# EAGLE design sensor_f1 (EAGLE 8.4.2)
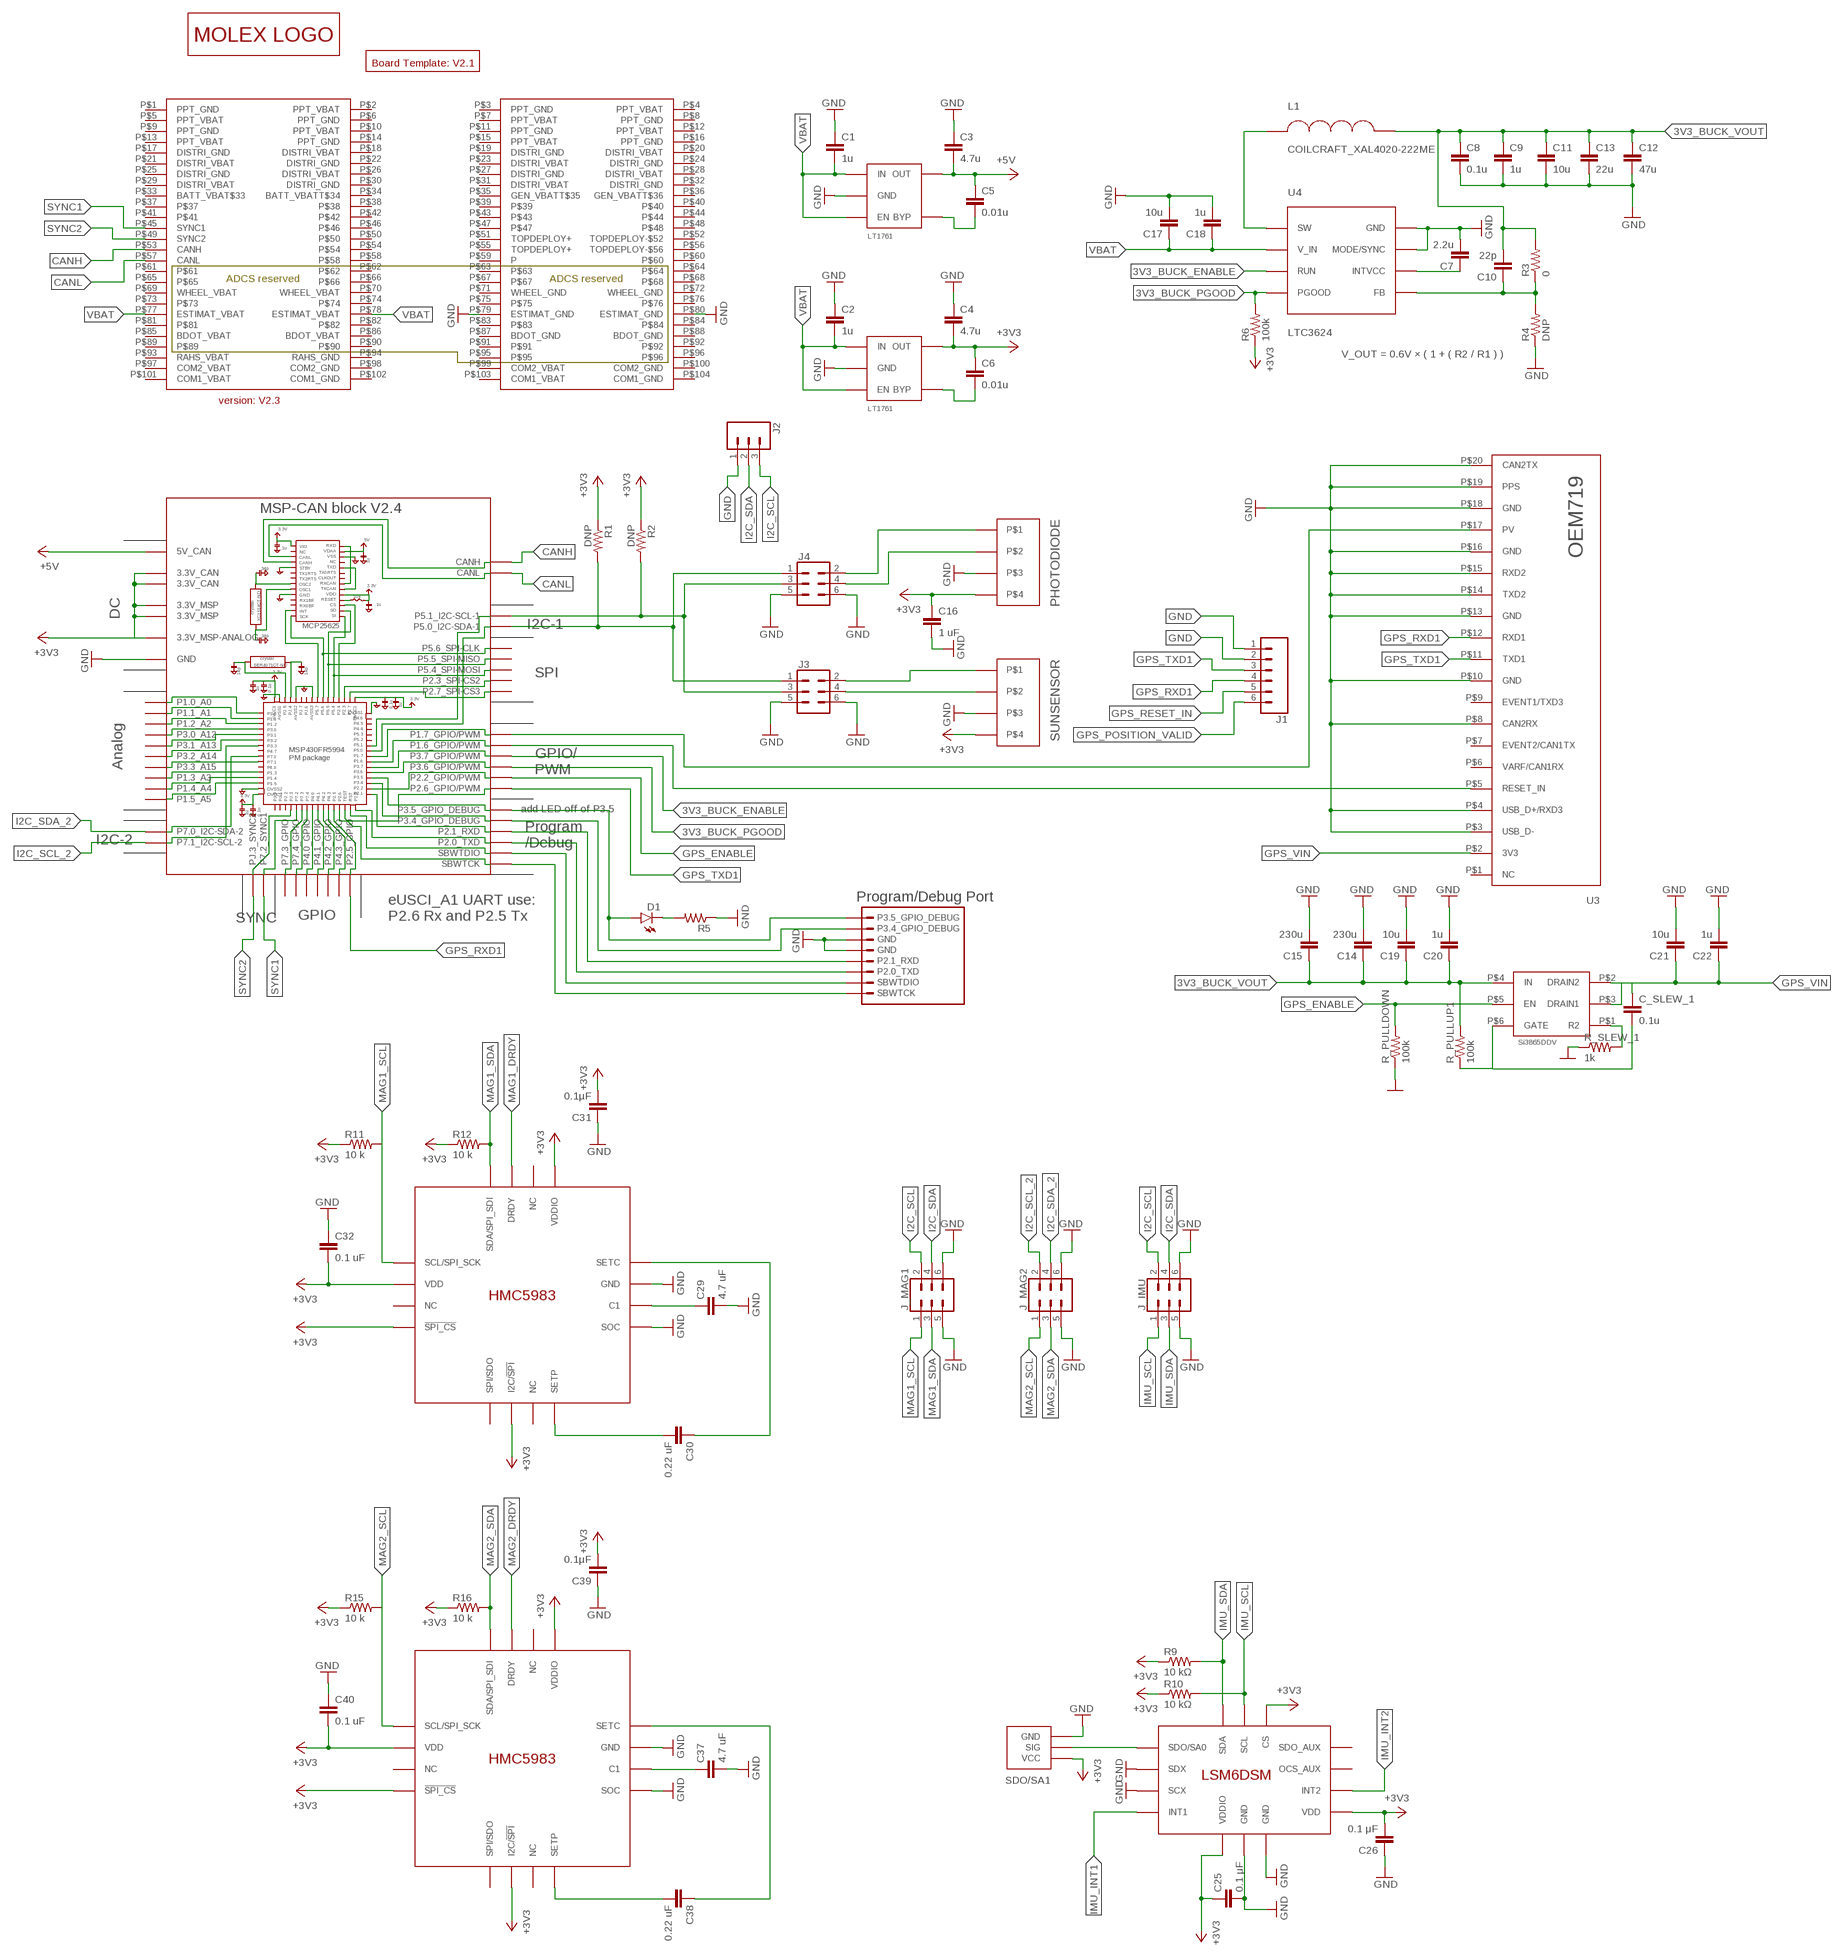
[diagram p0: schematic, sheet 1]

## Parts
B1  BOARD_TEMPLATESERCURED  [BOARD_TEMPLATE_SECURED]
BLK1  MSP-CAN_BLOCK  [MSP-CAN_BLOCK]
C1  1u  CAPACITOR0805  [0805]
C2  1u  CAPACITOR0805  [0805]
C3  4.7u  CAPACITOR0805  [0805]
C4  4.7u  CAPACITOR0805  [0805]
C5  0.01u  CAPACITOR0805  [0805]
C6  0.01u  CAPACITOR0805  [0805]
C7  2.2u  CAPACITOR0805  [0805]
C8  0.1u  CAPACITOR0805  [0805]
C9  1u  CAPACITOR0805  [0805]
C10  22p  CAPACITOR0805  [0805]
C11  10u  CAPACITOR0805  [0805]
C12  47u  CAPACITOR1206  [1206]
C13  22u  CAPACITOR1206  [1206]
C14  230u  CAPACITORPANASONIC_16SVPG270M  [PANASONIC_SVPG]
C15  230u  CAPACITORPANASONIC_16SVPG270M  [PANASONIC_SVPG]
C16  1 uF  CAPACITOR0805  [0805]
C17  10u  CAPACITOR0805  [0805]
C18  1u  CAPACITOR0805  [0805]
C19  10u  CAPACITOR0805  [0805]
C20  1u  CAPACITOR0805  [0805]
C21  10u  CAPACITOR0805  [0805]
C22  1u  CAPACITOR0805  [0805]
C25  0.1 μF  CAPACITOR0805  [0805]
C26  0.1 μF  CAPACITOR0805  [0805]
C29  4.7 uF  CAPACITOR0805  [0805]
C30  0.22 uF  CAPACITOR0805  [0805]
C31  0.1µF  CAPACITOR0805  [0805]
C32  0.1 uF  CAPACITOR0805  [0805]
C37  4.7 uF  CAPACITOR0805  [0805]
C38  0.22 uF  CAPACITOR0805  [0805]
C39  0.1µF  CAPACITOR0805  [0805]
C40  0.1 uF  CAPACITOR0805  [0805]
C_SLEW_1  0.1u  CAPACITOR0805  [0805]
CONN1  PC104_CONNECTOR  [PC104_CONNECTOR]
D1  LED  [LED-1206]
J1  CONN_06LOCK  [1X06_LOCK]
J2  CONN_03LOCK  [1X03_LOCK]
J3  CONN_03X22X3_SILK_MALE_PTH  [2X3]
J4  CONN_03X22X3_SILK_MALE_PTH  [2X3]
J_IMU  CONN_03X22X3_SILK_MALE_PTH  [2X3]
J_MAG1  CONN_03X22X3_SILK_MALE_PTH  [2X3]
J_MAG2  CONN_03X22X3_SILK_MALE_PTH  [2X3]
L1  COILCRAFT_XAL4020-222ME  [COILCRAFT_XAL4020]
PHOTODIODE  PICOLOCK_4  [PICOLOCK_4]
R1  DNP  RESISTOR0805  [0805]
R2  DNP  RESISTOR0805  [0805]
R3  0  RESISTOR0805  [0805]
R4  DNP  RESISTOR0805  [0805]
R5  RESISTOR0805  [0805]
R6  100k  RESISTOR0805  [0805]
R9  10 kΩ  RESISTOR0805  [0805]
R10  10 kΩ  RESISTOR0805  [0805]
R11  10 k  RESISTOR0805  [0805]
R12  10 k  RESISTOR0805  [0805]
R15  10 k  RESISTOR0805  [0805]
R16  10 k  RESISTOR0805  [0805]
R_PULLDOWN  100k  RESISTOR0805  [0805]
R_PULLUP1  100k  RESISTOR0805  [0805]
R_SLEW_1  1k  RESISTOR0805  [0805]
SDO/SA1  0_OHM_JUMPER  [0_OHM_JUMPER]
SUNSENSOR  PICOLOCK_4  [PICOLOCK_4]
U1  LT1761-X  [SOT-23-5]
U2  LT1761-X  [SOT-23-5]
U3  OEM719  [OEM719]
U4  LTC3624  [LTC3624]
U$1  LOGO_MOLEX  [LOGO_MOLEX]
U$2  PROGRAM/DEBUG_PORT  [1X08_CONNECTOR]
U$3  SI3865DDV  [TSOP-6]
U$5  LSM6DSM  [LSM6DSM]
U$6  HMC5983  [HMC5983]
U$8  HMC5983  [HMC5983]

## Nets
3V3_BUCK_ENABLE: BLK1.P3.7_GPIO/PWM U4.RUN
3V3_BUCK_FB: C10.1 R3.1 R4.2 U4.FB
3V3_BUCK_INTVCC: C7.1 U4.INTVCC
3V3_BUCK_PGOOD: BLK1.P3.6_GPIO/PWM R6.2 U4.PGOOD
3V3_BUCK_SW: L1.P$1 U4.SW
3V3_BUCK_VOUT: C8.1 C9.1 C10.2 C11.1 C12.1 C13.1 C14.POS C15.POS C19.1 C20.1 L1.P$2 R3.2 R_PULLUP1.2 U$3.P$4(IN)
+3V3: R6.1
CANH: BLK1.CANH CONN1.P$53(CANH)
CANL: BLK1.CANL CONN1.P$57(CANL)
GND: BLK1.GND@1(GND) BLK1.GND@2(GND) BLK1.GND@3(GND) BLK1.GND@4(GND) BLK1.GND@5(GND) BLK1.GND@7(GND) BLK1.GND@8(GND) BLK1.GND@9(GND) BLK1.GND@10(GND) BLK1.GND@11(GND) BLK1.GND@12(GND) BLK1.GND@13(GND) BLK1.GND@14(GND) BLK1.GND@15(GND) BLK1.GND@16(GND) BLK1.GND@17(GND) BLK1.GND@26(GND) C1.1 C2.1 C3.1 C4.1 C7.2 C8.2 C9.2 C11.2 C12.2 C13.2 C14.NEG C15.NEG C16.2 C17.2 C18.2 C19.2 C20.2 C21.2 C22.2 C25.2 C26.1 C29.2 C31.1 C32.1 C37.2 C39.1 C40.1 CONN1.P$79(ESTIMAT_GND) CONN1.P$80(ESTIMAT_GND) J1.1 J1.2 J2.1 J3.5 J3.6 J4.5 J4.6 J_IMU.5 J_IMU.6 J_MAG1.5 J_MAG1.6 J_MAG2.5 J_MAG2.6 PHOTODIODE.P$3 R4.1 R5.1 R_PULLDOWN.1 R_SLEW_1.1 SDO/SA1.P$1(GND) SUNSENSOR.P$3 U1.P$2(GND) U2.P$2(GND) U3.P$3(USB_D-) U3.P$4(USB_D+/RXD3) U3.P$8(CAN2RX) U3.P$10(GND) U3.P$13(GND) U3.P$14(TXD2) U3.P$15(RXD2) U3.P$16(GND) U3.P$18(GND) U3.P$19(PPS) U3.P$20(CAN2TX) U4.GND@1(GND) U4.GND@PAD(GND) U4.MODE/SYNC U$2.5(GND) U$2.6(GND) U$5.GND@1(GND) U$5.GND@2(GND) U$5.SCX U$5.SDX U$6.GND U$6.SOC U$8.GND U$8.SOC ; supply symbol labelled DGND
GPS_ENABLE: BLK1.P2.2_GPIO/PWM R_PULLDOWN.2 U$3.P$5(EN)
GPS_POSITION_VALID: BLK1.P1.7_GPIO/PWM J1.6 U3.P$17(PV)
GPS_RESET_IN: BLK1.P1.6_GPIO/PWM J1.5 U3.P$5(RESET_IN)
GPS_RXD1: BLK1.P2.5_GPIO J1.4 U3.P$12(RXD1)
GPS_TXD1: BLK1.P2.6_GPIO/PWM J1.3 U3.P$11(TXD1)
GPS_VIN: C21.1 C22.1 C_SLEW_1.1 U3.P$2(3V3) U$3.P$2(DRAIN2) U$3.P$3(DRAIN1)
I2C_SCL: BLK1.P5.1_I2C-SCL-1 J2.3 J3.3 J4.3 J_IMU.2 J_MAG1.2 R2.2
I2C_SCL_2: BLK1.P7.1_I2C-SCL-2 J_MAG2.2
I2C_SDA: BLK1.P5.0_I2C-SDA-1 J2.2 J3.1 J4.1 J_IMU.4 J_MAG1.4 R1.2
I2C_SDA_2: BLK1.P7.0_I2C-SDA-2 J_MAG2.4
IMU_INT1: U$5.INT1
IMU_INT2: U$5.INT2
IMU_SCL: J_IMU.1 R10.2 U$5.SCL
IMU_SDA: J_IMU.3 R9.2 U$5.SDA
LDO_3V3: BLK1.3.3V@CAN1(3.3V_CAN) BLK1.3.3V@CAN2(3.3V_CAN) BLK1.3.3V@MSP1(3.3V_MSP) BLK1.3.3V@MSP2(3.3V_MSP) BLK1.3.3V_ANALOG@MSP2(3.3V_MSP-ANALOG) C4.2 C6.1 C16.1 C25.1 C26.2 C31.2 C32.2 C39.2 C40.2 PHOTODIODE.P$4 R1.1 R2.1 R9.1 R10.1 R11.1 R12.1 R15.1 R16.1 SDO/SA1.P$3(VCC) SUNSENSOR.P$4 U2.P$5(OUT) U$5.CS U$5.VDD U$5.VDDIO U$6.!SPI_CS U$6.I2C/!SPI U$6.VDD U$6.VDDIO U$8.!SPI_CS U$8.I2C/!SPI U$8.VDD U$8.VDDIO ; supply symbol labelled +3V3
LDO_3V3_BYP: C6.2 U2.P$4(BYP)
LDO_5V: BLK1.5V(5V_CAN) C3.2 C5.1 U1.P$5(OUT) ; supply symbol labelled +5V
LDO_5V_BYP: C5.2 U1.P$4(BYP)
MA1G_C2: C29.1 U$6.C1
MAG1_DRDY: U$6.DRDY
MAG1_SCL: J_MAG1.1 R11.2 U$6.SCL/SPI_SCK
MAG1_SDA: J_MAG1.3 R12.2 U$6.SDA/SPI_SDI
MAG1_SETC1: C30.1 U$6.SETC
MAG1_SETP1: C30.2 U$6.SETP
MAG2_C1: C37.1 U$8.C1
MAG2_DRDY: U$8.DRDY
MAG2_SCL: J_MAG2.1 R15.2 U$8.SCL/SPI_SCK
MAG2_SDA: J_MAG2.3 R16.2 U$8.SDA/SPI_SDI
MAG2_SETC: C38.1 U$8.SETC
MAG2_SETP: C38.2 U$8.SETP
N$1: BLK1.P3.5_GPIO_DEBUG D1.A U$2.8(P3.5_GPIO_DEBUG)
N$2: R_SLEW_1.2 U$3.P$1(R2)
N$3: BLK1.P3.4_GPIO_DEBUG U$2.7(P3.4_GPIO_DEBUG)
N$4: C_SLEW_1.2 R_PULLUP1.1 U$3.P$6(GATE)
N$5: BLK1.P2.1_RXD U$2.4(P2.1_RXD)
N$6: BLK1.P2.0_TXD U$2.3(P2.0_TXD)
N$7: BLK1.SBWTDIO U$2.2(SBWTDIO)
N$8: BLK1.SBWTCK U$2.SBWTCK
N$9: D1.C R5.2
N$11: SDO/SA1.P$2(SIG) U$5.SDO/SA0
PHOTODIODE_SCL: J4.4 PHOTODIODE.P$2
PHOTODIODE_SDA: J4.2 PHOTODIODE.P$1
SUNSENSOR_SCL: J3.4 SUNSENSOR.P$2
SUNSENSOR_SDA: J3.2 SUNSENSOR.P$1
SYNC1: BLK1.P7.2_SYNC1 CONN1.P$45(SYNC1)
SYNC2: BLK1.PJ.3_SYNC2 CONN1.P$49(SYNC2)
VBAT: C1.2 C2.2 C17.1 C18.1 CONN1.P$77(ESTIMAT_VBAT) CONN1.P$78(ESTIMAT_VBAT) U1.P$1(IN) U1.P$3(EN) U2.P$1(IN) U2.P$3(EN) U4.V_IN
Unconnected: BLK1.P1.0_A0 BLK1.P1.1_A1 BLK1.P1.2_A2 BLK1.P1.3_A3 BLK1.P1.4_A4 BLK1.P1.5_A5 BLK1.P2.4_SPI-CS2(P2.3_SPI-CS2) BLK1.P2.7_SPI-CS3 BLK1.P3.0_A12 BLK1.P3.1_A13 BLK1.P3.2_A14 BLK1.P3.3_A15 BLK1.P4.0_GPIO BLK1.P4.1_GPIO BLK1.P4.2_GPIO BLK1.P4.3_GPIO BLK1.P5.4_SPI-MOSI BLK1.P5.5_SPI-MISO BLK1.P5.6_SPI-CLK BLK1.P7.3_GPIO BLK1.P7.4_GPIO CONN1.P$1(PPT_GND) CONN1.P$2(PPT_VBAT) CONN1.P$3(PPT_GND) CONN1.P$4(PPT_VBAT) CONN1.P$5(PPT_VBAT) CONN1.P$6(PPT_GND) CONN1.P$7(PPT_VBAT) CONN1.P$8(PPT_GND) CONN1.P$9(PPT_GND) CONN1.P$10(PPT_VBAT) CONN1.P$11(PPT_GND) CONN1.P$12(PPT_VBAT) CONN1.P$13(PPT_VBAT) CONN1.P$14(PPT_GND) CONN1.P$15(PPT_VBAT) CONN1.P$16(PPT_GND) CONN1.P$17(DISTRI_GND) CONN1.P$18(DISTRI_VBAT) CONN1.P$19(DISTRI_GND) CONN1.P$20(DISTRI_VBAT) CONN1.P$21(DISTRI_VBAT) CONN1.P$22(DISTRI_GND) CONN1.P$23(DISTRI_VBAT) CONN1.P$24(DISTRI_GND) CONN1.P$25(DISTRI_GND) CONN1.P$26(DISTRI_VBAT) CONN1.P$27(DISTRI_GND) CONN1.P$28(DISTRI_VBAT) CONN1.P$29(DISTRI_VBAT) CONN1.P$30(DISTRI_GND) CONN1.P$31(DISTRI_VBAT) CONN1.P$32(DISTRI_GND) CONN1.P$33(BATT_VBAT$33) CONN1.P$34(BATT_VBATT$34) CONN1.P$35(GEN_VBATT$35) CONN1.P$36(GEN_VBATT$36) CONN1.P$37 CONN1.P$38 CONN1.P$39 CONN1.P$40 CONN1.P$41 CONN1.P$42 CONN1.P$43 CONN1.P$44 CONN1.P$46 CONN1.P$47 CONN1.P$48 CONN1.P$50 CONN1.P$51(TOPDEPLOY+) CONN1.P$52(TOPDEPLOY-$52) CONN1.P$54 CONN1.P$55(TOPDEPLOY+) CONN1.P$56(TOPDEPLOY-$56) CONN1.P$58 CONN1.P$59(P) CONN1.P$60 CONN1.P$61 CONN1.P$62 CONN1.P$63 CONN1.P$64 CONN1.P$65 CONN1.P$66 CONN1.P$67 CONN1.P$68 CONN1.P$69(WHEEL_VBAT) CONN1.P$70(WHEEL_VBAT) CONN1.P$71(WHEEL_GND) CONN1.P$72(WHEEL_GND) CONN1.P$73 CONN1.P$74 CONN1.P$75 CONN1.P$76 CONN1.P$81 CONN1.P$82 CONN1.P$83 CONN1.P$84 CONN1.P$85(BDOT_VBAT) CONN1.P$86(BDOT_VBAT) CONN1.P$87(BDOT_GND) CONN1.P$88(BDOT_GND) CONN1.P$89 CONN1.P$90 CONN1.P$91 CONN1.P$92 CONN1.P$93(RAHS_VBAT) CONN1.P$94(RAHS_GND) CONN1.P$95 CONN1.P$96 CONN1.P$97(COM2_VBAT) CONN1.P$98(COM2_GND) CONN1.P$99(COM2_VBAT) CONN1.P$100(COM2_GND) CONN1.P$101(COM1_VBAT) CONN1.P$102(COM1_GND) CONN1.P$103(COM1_VBAT) CONN1.P$104(COM1_GND) U3.P$1(NC) U3.P$6(VARF/CAN1RX) U3.P$7(EVENT2/CAN1TX) U3.P$9(EVENT1/TXD3) U$5.OCS_AUX U$5.SDO_AUX U$6.NC@1(NC) U$6.NC@2(NC) U$6.NC@3(NC) U$6.SPI_SDO(SPI/SDO) U$8.NC@1(NC) U$8.NC@2(NC) U$8.NC@3(NC) U$8.SPI_SDO(SPI/SDO)

## Notes on the sheet
- V_OUT = 0.6V × ( 1 + ( R2 / R1 ) )

## Library data of the parts
B1 = DubSat1 Components:BOARD_TEMPLATE
BLK1 = DubSat1 Components:MSP-CAN_BLOCK
C1-C22 C25 C26 C29-C32 C37-C40 C_SLEW_1 = DubSat1 Components:CAPACITOR: Capacitor Standard 0603 ceramic capacitor, and 0.1" leaded capacitor.
CONN1 = DubSat1 Components:PC104_CONNECTOR
D1 = DubSat1 Components:LED
J1 = SparkFun-Connectors:CONN_06: Multi connection point. Often used as Generic Header-pin footprint for 0.1 inch spaced/style header connections On any of the 0.1 inch spaced packages, you can populate with these: Break Away Headers - Straight <https://www.sparkfun.com/products/116> (PRT-00116) Break Away Male Headers - Right Angle <https://www.sparkfun.com/products/553> (PRT-00553) Female Headers <https://www.sparkfun.com/products/115> (PRT-00115) Break Away Headers - Machine Pin <https://www.sparkfun.com/products/117> (PRT-00117) Break Away Female Headers - Swiss Machine Pin <https://www.sparkfun.com/products/743> (PRT-00743) Arduino Stackable Header - 6 Pin <https://www.sparkfun.com/products/9280> (PRT-09280) For SCREWTERMINALS and SPRING TERMINALS visit here: Screw Terimnals on SparkFun.com <https://www.sparkfun.com/search/results?term=Screw+Terminals> (5mm/3.5mm/2.54mm spacing) This device is also useful as a general connection point to wire up your design to another part of your project. Our various solder wires solder well into these plated through hole pads. Hook-Up Wire - Assortment (Stranded, 22 AWG) <https://www.sparkfun.com/products/11375> (PRT-11375) Hook-Up Wire - Assortment (Solid Core, 22 AWG) <https://www.sparkfun.com/products/11367> (PRT-11367) View the entire wire category on our website here <https://www.sparkfun.com/categories/141>
J2 = SparkFun-Connectors:CONN_03: Multi connection point. Often used as Generic Header-pin footprint for 0.1 inch spaced/style header connections On any of the 0.1 inch spaced packages, you can populate with these: Break Away Headers - Straight <https://www.sparkfun.com/products/116> (PRT-00116) Break Away Male Headers - Right Angle <https://www.sparkfun.com/products/553> (PRT-00553) Female Headers <https://www.sparkfun.com/products/115> (PRT-00115) Break Away Headers - Machine Pin <https://www.sparkfun.com/products/117> (PRT-00117) Break Away Female Headers - Swiss Machine Pin <https://www.sparkfun.com/products/743> (PRT-00743) Stackable Header - 3 Pin (Female, 0.1") <https://www.sparkfun.com/products/13875> (PRT-13875) For SCREWTERMINALS and SPRING TERMINALS visit here: Screw Terimnals on SparkFun.com <https://www.sparkfun.com/search/results?term=Screw+Terminals> (5mm/3.5mm/2.54mm spacing) This device is also useful as a general connection point to wire up your design to another part of your project. Our various solder wires solder well into these plated through hole pads. Hook-Up Wire - Assortment (Stranded, 22 AWG) <https://www.sparkfun.com/products/11375> (PRT-11375) Hook-Up Wire - Assortment (Solid Core, 22 AWG) <https://www.sparkfun.com/products/11367> (PRT-11367) View the entire wire category on our website here <https://www.sparkfun.com/categories/141> Special notes: Molex polarized connector foot print use with SKU : PRT-08232 with associated crimp pins and housings.
J3 J4 J_IMU J_MAG1 J_MAG2 = SparkFun-Connectors:CONN_03X2: Multi connection point. Often used as Generic Header-pin footprint for 0.1 inch spaced/style header connections You can populate with any combo of single row headers, but if you'd like an exact match, check these: Header - 2x3 (Male, 0.1") <https://www.sparkfun.com/products/12807> (PRT-12807) Header - 2x3 (Female, 0.1") <https://www.sparkfun.com/products/13010> (PRT-13010) 2x3 Pin Shrouded Header <https://www.sparkfun.com/products/10877> (PRT-10877) On any of the 0.1 inch spaced packages, you can populate with these: Break Away Headers - Straight <https://www.sparkfun.com/products/116> (PRT-00116) Break Away Male Headers - Right Angle <https://www.sparkfun.com/products/553> (PRT-00553) Female Headers <https://www.sparkfun.com/products/115> (PRT-00115) Break Away Headers - Machine Pin <https://www.sparkfun.com/products/117> (PRT-00117) Break Away Female Headers - Swiss Machine Pin <https://www.sparkfun.com/products/743> (PRT-00743) Special note: the shrouded connector mates well with our 3x2 ribbon cables: Ribbon Crimp Connector - 6-pin (2x3, Female) <https://www.sparkfun.com/products/10651> (PRT-10651) Ribbon Cable - 6 wire (15ft) <https://www.sparkfun.com/products/10646> (PRT-10646); PROD_ID: CONN-09701
L1 = DubSat1 Components:COILCRAFT_XAL4020-222ME
PHOTODIODE SUNSENSOR = DubSat1 Components:PICOLOCK_4
R1-R6 R9-R12 R15 R16 R_PULLDOWN R_PULLUP1 R_SLEW_1 = DubSat1 Components:RESISTOR: Resistor Basic schematic elements and footprints for 0603, 1206, and PTH resistors.
SDO/SA1 = DubSat1 Components:0_OHM_JUMPER
U1 U2 = DubSat1 Components:LT1761-X
U3 = DubSat1 Components:OEM719
U4 = DubSat1 Components:LTC3624
U$1 = HuskySat-1 Logos:LOGO_MOLEX
U$2 = DubSat1 Components:PROGRAM/DEBUG_PORT
U$3 = DubSat1 Components:SI3865DDV
U$5 = LSM6DSM:LSM6DSM
U$6 U$8 = DubSat1 Components:HMC5983

## Board
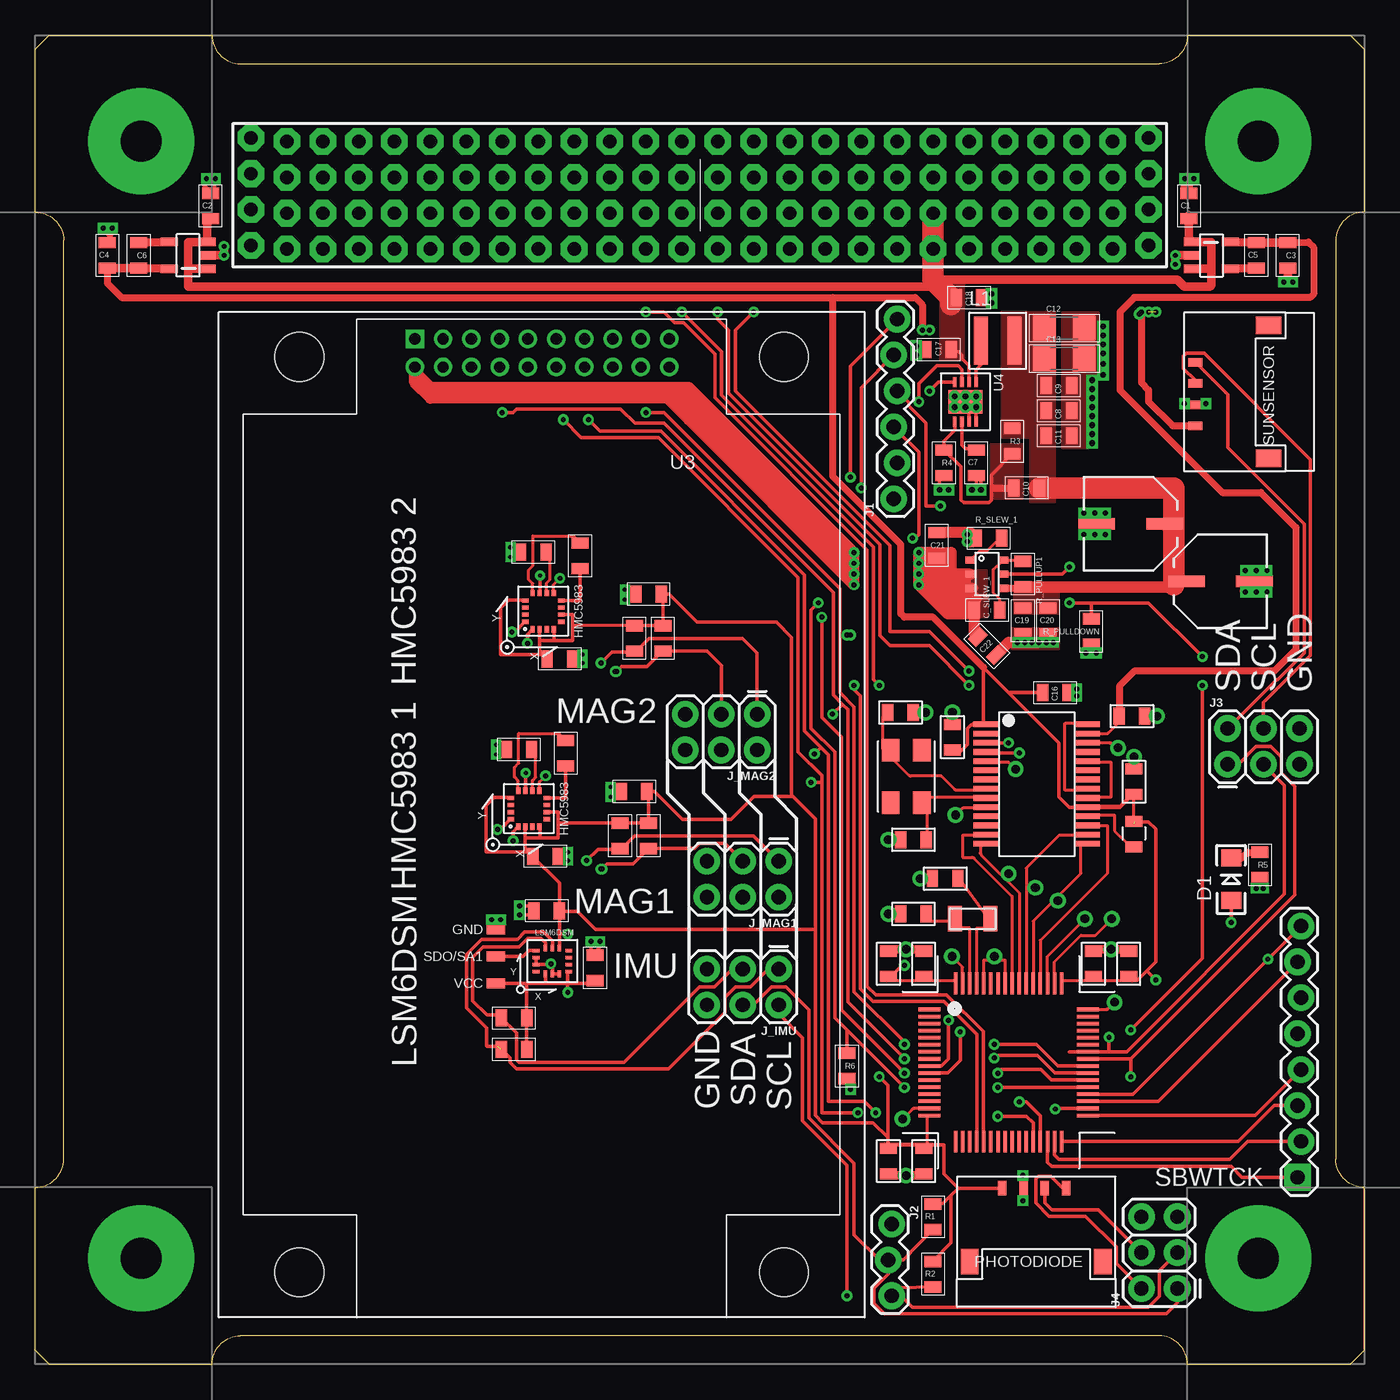
[diagram p1: board, top side]
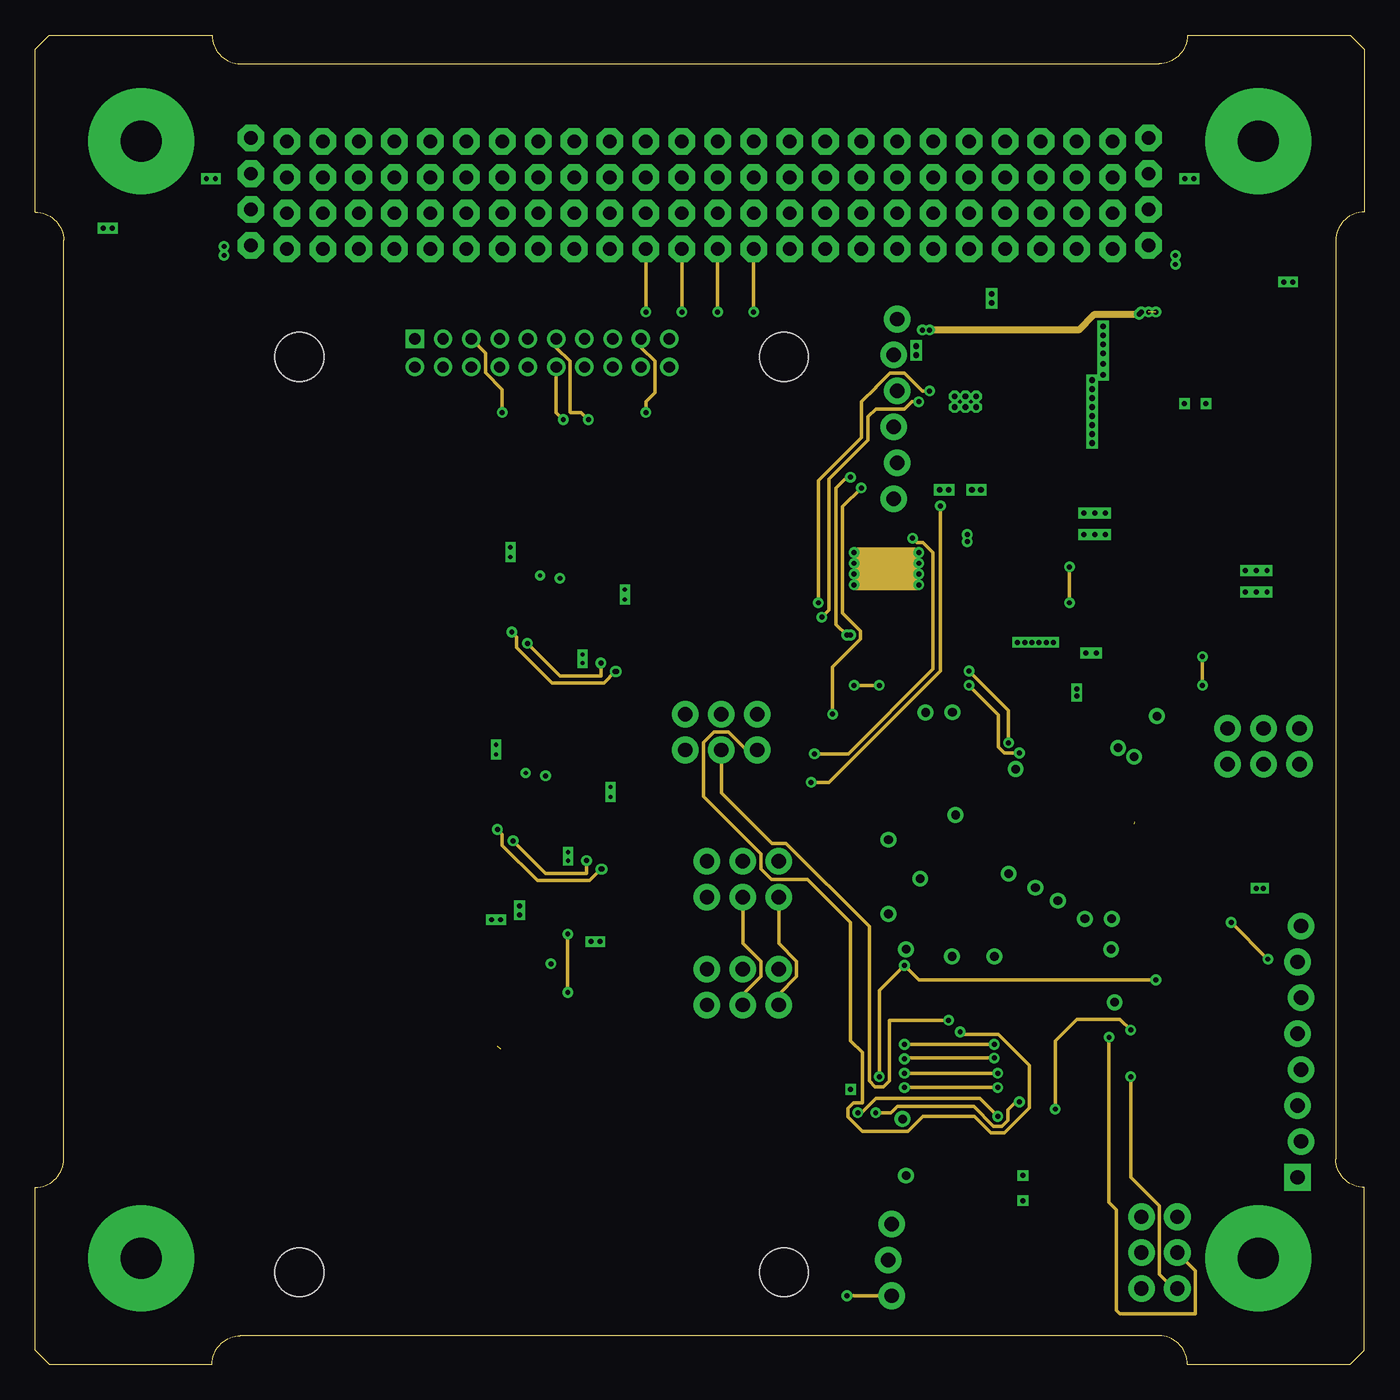
[diagram p2: board, inner layer Route2]
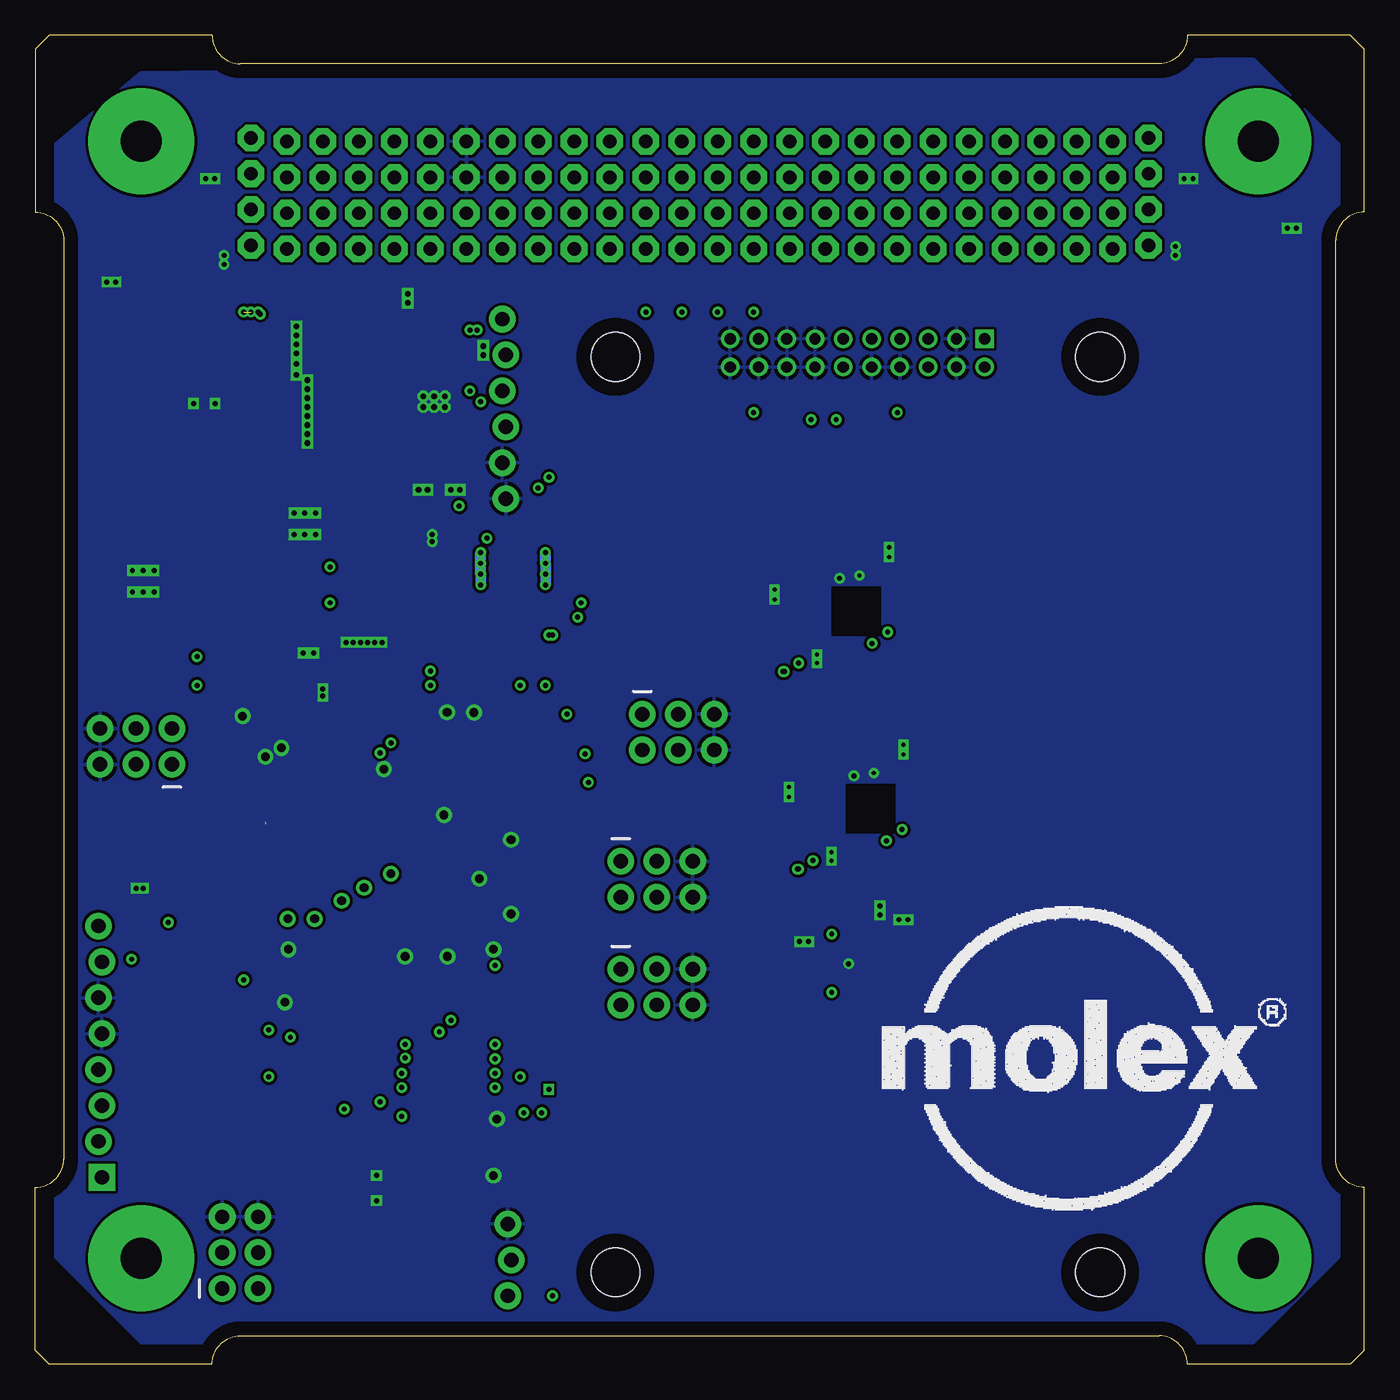
[diagram p3: board, bottom side, seen from below]

Size 94 x 94 mm. Coordinates in mm from the lower left corner, seen from the top.
Copper layers (1*16): Top 0.035mm / dielectric 1.5mm / Bottom 0.035mm
Design rules "default *": minimum track width 8mil, minimum drill 0.4mm, track to track 8mil, track to pad 8mil, pad to pad 8mil, via to via 8mil, smd to smd 0mil, copper to edge 40mil, drill to drill 6mil, minimum pad ring 10mil, minimum via ring 8mil, stop-mask expansion 4mil, vias tented up to drill 0mil, thermal gap 10mil

### Footprints (pad centres in the part's own frame; a part is rotated, then mirrored left to right if it is on the bottom)
BOARD_TEMPLATE_SECURED = drill 2.9 pad 7.5: P$1 -39.5,39.5; P$2 -39.5,-39.5; P$3 39.5,-39.5; P$4 39.5,39.5
MSP-CAN_BLOCK = smd 1.2 x 0.8: 1 -6,6.08; 2 -6,7.88; 3 -8.5,6.08; 4 -8.5,7.88; 9 -8.5,-6.08; 10 -8.5,-7.88; 11 -6,-6.08; 12 -6,-7.88; 13 8.5,6.08; 14 8.5,7.88; 15 6,6.08; 16 6,7.88; 23 8.875,18.955; 24 8.875,20.755; 25 8.875,17.045; 26 8.875,15.245; 27 -3.975,22.105; 28 -3.975,23.905 | smd 1 x 0.25: 3.3V@CAN1 -3.975,22.025; 3.3V@CAN2 8.875,18.875; 3.3V@MSP1 8.501,5.884; 3.3V@MSP2 -8.533,-5.962; 3.3V_ANALOG@MSP2 -8.482,5.904 | smd 0.8 x 1.2: 5 -5.83,10.5; 6 -7.63,10.5; 7 -3.58,13; 8 -5.38,13; 17 -8.545,24.75; 18 -6.745,24.75; 19 -5.83,15.75; 20 -7.63,15.75; 21 7.83,24.5; 22 9.63,24.5 | smd 0.25 x 1: 5V 7.65,24.5 | smd 1.75 x 0.4: CANH -1.6,21.96; CANL -1.6,22.61; P$65 -1.6,23.91; P$66 -1.6,23.26; P$69 -1.6,21.31; P$70 -1.6,20.66; P$71 -1.6,20.01; P$72 -1.6,19.36; P$73 -1.6,18.71; P$74 -1.6,18.06; P$75 -1.6,17.41; P$76 -1.6,16.76; P$77 -1.6,16.11; P$78 -1.6,15.46; P$79 5.6,15.46; P$80 5.6,16.11; P$81 5.6,16.76; P$82 5.6,17.41; P$83 5.6,18.06; P$84 5.6,18.71; P$85 5.6,19.36; P$86 5.6,20.01; P$87 5.6,20.66; P$88 5.6,21.31; P$89 5.6,21.96; P$90 5.6,22.61; P$91 5.6,23.26; P$92 5.6,23.91 | drill 0.61: GND@1 -3.975,24.775; GND@2 -5.875,24.75; GND@3 -3.75,17.5; GND@4 0.5,20.75; GND@5 -8.5,15.75; GND@7 -8.5,10.5; GND@8 -7.25,8; GND@9 -4,7.5; GND@10 -1,7.5; GND@11 7.75,22.25; GND@12 10.5,24.5; GND@13 8.875,21.625; GND@14 7.25,8; GND@15 7.5,4.25; GND@16 -7.5,-4; GND@17 -7.25,-8; GND@26 -6.25,13; P2.4_SPI-CS2 5.397,10.16; P2.7_SPI-CS3 7.303,10.16; P5.4_SPI-MOSI 3.487,11.434; P5.5_SPI-MISO 1.9,12.354; P5.6_SPI-CLK 0,13.348 | smd 1.55 x 0.25: P1.0_A0 -5.6,3.75; P1.1_A1 -5.6,3.25; P1.2_A2 -5.6,2.75; P1.3_A3 -5.6,-1.75; P1.4_A4 -5.6,-2.25; P1.5_A5 -5.6,-2.75; P1.6_GPIO/PWM 5.6,-0.75; P1.7_GPIO/PWM 5.6,-0.25; P2.1_RXD 5.6,-3.75; P2.2_GPIO/PWM 5.6,-3.25; P3.0_A12 -5.6,2.25; P3.1_A13 -5.6,1.75; P3.2_A14 -5.6,1.25; P3.3_A15 -5.6,0.75; P3.4_GPIO_DEBUG 5.6,-2.75; P3.5_GPIO_DEBUG 5.6,-2.25; P3.6_GPIO/PWM 5.6,-1.75; P3.7_GPIO/PWM 5.6,-1.25; P5.0_I2C-SDA-1 5.6,0.25; P5.1_I2C-SCL-1 5.6,0.75; P7.0_I2C-SDA-2 -5.6,-0.25; P7.1_I2C-SCL-2 -5.6,-0.75; P$8 -5.6,0.25; P$11 -5.6,-1.25; P$15 -5.6,-3.25; P$16 -5.6,-3.75; P$43 5.6,1.25; P$44 5.6,1.75; P$45 5.6,2.25; P$46 5.6,2.75; P$47 5.6,3.25; P$48 5.6,3.75 | smd 0.25 x 1.55: P2.0_TXD 3.75,-5.6; P2.5_GPIO 1.75,-5.6; P2.6_GPIO/PWM 2.25,-5.6; P4.0_GPIO -0.25,-5.6; P4.1_GPIO 0.25,-5.6; P4.2_GPIO 0.75,-5.6; P4.3_GPIO 1.25,-5.6; P7.2_SYNC1 -1.75,-5.6; P7.3_GPIO -1.25,-5.6; P7.4_GPIO -0.75,-5.6; P$17 -3.75,-5.6; P$18 -3.25,-5.6; P$19 -2.75,-5.6; P$49 3.75,5.6; P$50 3.25,5.6; P$51 2.75,5.6; P$52 2.25,5.6; P$53 1.75,5.6; P$54 1.25,5.6; P$55 0.75,5.6; P$56 0.25,5.6; P$57 -0.25,5.6; P$58 -0.75,5.6; P$59 -1.25,5.6; P$60 -1.75,5.6; P$61 -2.25,5.6; P$62 -2.75,5.6; P$63 -3.25,5.6; P$64 -3.75,5.6; PJ.3_SYNC2 -2.25,-5.6; SBWTCK 2.75,-5.6; SBWTDIO 3.25,-5.6 | smd 1 x 1.8: P$93 -3.79,10.16; P$94 -1.29,10.16 | smd 1.25 x 1.6: P$104 -6.13,18.38; P$105 -6.13,22.08; P$106 -8.33,22.08; P$107 -8.33,18.38
0805 = smd 0.8 x 1.2: 1 -0.9,0; 2 0.9,0
1206 = smd 1.6 x 1.8: 1 -1.4,0; 2 1.4,0
PANASONIC_SVPG = smd 0.8 x 2.6: NEG 0,2.4; POS 0,-2.4
PC104_CONNECTOR = drill 0.953 pad 1.88 octagon: P$1 -31.75,32.134; P$2 -31.75,34.674; P$3 -31.75,37.214; P$4 -31.75,39.754; P$5 -29.21,31.88; P$6 -29.21,34.42; P$7 -29.21,36.96; P$8 -29.21,39.5; P$9 -26.67,31.88; P$10 -26.67,34.42; P$11 -26.67,36.96; P$12 -26.67,39.5; P$13 -24.13,31.88; P$14 -24.13,34.42; P$15 -24.13,36.96; P$16 -24.13,39.5; P$17 -21.59,31.88; P$18 -21.59,34.42; P$19 -21.59,36.96; P$20 -21.59,39.5; P$21 -19.05,31.88; P$22 -19.05,34.42; P$23 -19.05,36.96; P$24 -19.05,39.5; P$25 -16.51,31.88; P$26 -16.51,34.42; P$27 -16.51,36.96; P$28 -16.51,39.5; P$29 -13.97,31.88; P$30 -13.97,34.42; P$31 -13.97,36.96; P$32 -13.97,39.5; P$33 -11.43,31.88; P$34 -11.43,34.42; P$35 -11.43,36.96; P$36 -11.43,39.5; P$37 -8.89,31.88; P$38 -8.89,34.42; P$39 -8.89,36.96; P$40 -8.89,39.5; P$41 -6.35,31.88; P$42 -6.35,34.42; P$43 -6.35,36.96; P$44 -6.35,39.5; P$45 -3.81,31.88; P$46 -3.81,34.42; P$47 -3.81,36.96; P$48 -3.81,39.5; P$49 -1.27,31.88; P$50 -1.27,34.42; P$51 -1.27,36.96; P$52 -1.27,39.5; P$53 1.27,31.88; P$54 1.27,34.42; P$55 1.27,36.96; P$56 1.27,39.5; P$57 3.81,31.88; P$58 3.81,34.42; P$59 3.81,36.96; P$60 3.81,39.5; P$61 6.35,31.88; P$62 6.35,34.42; P$63 6.35,36.96; P$64 6.35,39.5; P$65 8.89,31.88; P$66 8.89,34.42; P$67 8.89,36.96; P$68 8.89,39.5; P$69 11.43,31.88; P$70 11.43,34.42; P$71 11.43,36.96; P$72 11.43,39.5; P$73 13.97,31.88; P$74 13.97,34.42; P$75 13.97,36.96; P$76 13.97,39.5; P$77 16.51,31.88; P$78 16.51,34.42; P$79 16.51,36.96; P$80 16.51,39.5; P$81 19.05,31.88; P$82 19.05,34.42; P$83 19.05,36.96; P$84 19.05,39.5; P$85 21.59,31.88; P$86 21.59,34.42; P$87 21.59,36.96; P$88 21.59,39.5; P$89 24.13,31.88; P$90 24.13,34.42; P$91 24.13,36.96; P$92 24.13,39.5; P$93 26.67,31.88; P$94 26.67,34.42; P$95 26.67,36.96; P$96 26.67,39.5; P$97 29.21,31.88; P$98 29.21,34.42; P$99 29.21,36.96; P$100 29.21,39.5; P$101 31.75,32.134; P$102 31.75,34.674; P$103 31.75,37.214; P$104 31.75,39.754
LED-1206 = smd 1.2 x 1.4: A -1.5,0; C 1.5,0
1X06_LOCK = drill 1.016 pad 1.88: 1 0,0; 2 2.54,-0.254; 3 5.08,0; 4 7.62,-0.254; 5 10.16,0; 6 12.7,-0.254
1X03_LOCK = drill 1.016 pad 1.88: 1 0,0.127; 2 2.54,-0.127; 3 5.08,0.127
2X3 = drill 1.016 pad 1.88: 1 0,0; 2 0,2.54; 3 2.54,0; 4 2.54,2.54; 5 5.08,0; 6 5.08,2.54
COILCRAFT_XAL4020 = smd 0.98 x 3.4: P$1 -1.185,0; P$2 1.185,0
PICOLOCK_4 = smd 1.25 x 1.8: MNT@1 -2.605,5.2; MNT@2 6.805,5.2 | smd 0.6 x 1: P$1 0,0; P$2 1.5,0; P$3 3,0; P$4 4.5,0
0_OHM_JUMPER = smd 1.3 x 0.7: P$1 0,-1.9; P$2 0,0; P$3 0,1.9
SOT-23-5 = smd 0.6 x 1.2: P$1 -0.95,-1.35; P$2 0,-1.35; P$3 0.95,-1.35; P$4 0.95,1.35; P$5 -0.95,1.35
OEM719 = drill 0.8 square: P$1 69.22,31.84 | drill 0.8: P$2 67.22,31.84; P$3 69.22,29.84; P$4 67.22,29.84; P$5 69.22,27.84; P$6 67.22,27.84; P$7 69.22,25.84; P$8 67.22,25.84; P$9 69.22,23.84; P$10 67.22,23.84; P$11 69.22,21.84; P$12 67.22,21.84; P$13 69.22,19.84; P$14 67.22,19.84; P$15 69.22,17.84; P$16 67.22,17.84; P$17 69.22,15.84; P$18 67.22,15.84; P$19 69.22,13.84; P$20 67.22,13.84 | hole 3.45: 3.18,5.72; 3.18,40.01; 67.95,5.72; 67.95,40.01
LTC3624 = smd 0.7 x 0.25: FB 1.4,-0.75; GND@1 1.4,0.75; INTVCC 1.4,-0.25; MODE/SYNC 1.4,0.25; PGOOD -1.4,-0.75; RUN -1.4,-0.25; SW -1.4,0.75; V_IN -1.4,0.25 | smd 1.65 x 2.38: GND@PAD 0,0
1X08_CONNECTOR = drill 1.016 pad 1.88: 2 2.54,-0.127; 3 5.08,0.127; 4 7.62,-0.127; 5 10.16,0.127; 6 12.7,-0.127; 7 15.24,0.127; 8 17.78,-0.127 | drill 1.016 pad 1.88 square: SBWTCK 0,0.127
TSOP-6 = smd 0.508 x 0.7: P$1 -1,-1.162; P$2 0,-1.162; P$3 1,-1.162; P$4 1,1.162; P$5 0,1.162; P$6 -1,1.162
LSM6DSM = smd 0.25 x 0.475: CS 0.5,0.912; GND@1 0,-0.912; GND@2 0.5,-0.912; SCL 0,0.912; SDA -0.5,0.912; VDDIO -0.5,-0.912 | smd 0.475 x 0.25: INT1 -1.163,-0.75; INT2 1.163,-0.25; OCS_AUX 1.163,0.25; SCX -1.163,-0.25; SDO/SA0 -1.163,0.75; SDO_AUX 1.163,0.75; SDX -1.163,0.25; VDD 1.163,-0.75
HMC5983 = smd 0.45 x 0.3: !SPI_CS -1.275,-0.75; C1 1.275,-0.25; GND 1.275,0.25; NC@3 -1.275,-0.25; SCL/SPI_SCK -1.275,0.75; SETC 1.275,0.75; SOC 1.275,-0.75; VDD -1.275,0.25 | smd 0.3 x 0.45: DRDY -0.25,1.275; I2C/!SPI -0.25,-1.275; NC@1 0.25,1.275; NC@2 0.25,-1.275; SDA/SPI_SDI -0.75,1.275; SETP 0.75,-1.275; SPI_SDO -0.75,-1.275; VDDIO 0.75,1.275

### Placement (x,y rotation side)
B1  47,47 0 top
BLK1  68.84,21.35 0 top
C1  81.61,81.92 270 top
C2  12.39,81.92 270 top
C3  88.59,78.43 90 top
C4  5.09,78.43 270 top
C5  86.37,78.43 270 top
C6  7.31,78.43 90 top
C7  66.56,63.76 270 top
C8  72.4,67.45 0 top
C9  72.4,69.22 0 top
C10  70.11,61.99 0 top
C11  72.4,65.67 0 top
C12  72.78,73.29 0 top
C13  72.78,71.13 0 top
C14  83.83,55.38 270 top
C15  77.48,59.45 90 top
C16  72.15,47.51 0 top
C17  63.89,71.77 180 top
C18  66.05,75.45 0 top
C19  69.86,52.59 270 top
C20  71.64,52.59 270 top
C21  63.76,57.92 90 top
C22  67.32,50.81 315 top
C25  36.17,32.07 180 top
C26  39.59,28.03 270 top
C29  34.21,43.48 180 top
C30  37.52,43.21 270 top
C31  42.36,40.51 0 top
C32  36.09,35.92 180 top
C37  35.22,57.45 180 top
C38  38.53,57.18 270 top
C39  43.37,54.48 0 top
C40  37.1,49.89 180 top
C_SLEW_1  67.32,53.35 0 top
CONN1  47,47 0 top
D1  84.59,34.3 90 top
J1  60.72,61.22 90 top
J2  60.46,9.92 270 top
J3  84.34,42.43 0 top
J4  80.78,5.34 90 top
J_IMU  52.59,27.95 180 top
J_MAG1  52.59,35.57 180 top
J_MAG2  51.06,45.98 180 top
L1  68.08,72.4 0 top
PHOTODIODE  72.91,12.46 180 top
R1  63.51,10.42 270 top
R2  63.51,6.36 270 top
R3  69.1,65.29 90 top
R4  64.27,63.76 90 top
R5  86.62,35.32 90 top
R6  57.41,21.09 90 top
R9  33.86,24.49 180 top
R10  33.86,22.27 180 top
R11  41.36,37.37 270 top
R12  43.38,37.37 270 top
R15  42.37,51.34 270 top
R16  44.39,51.34 270 top
R_PULLDOWN  74.69,51.83 90 top
R_PULLUP1  69.86,55.89 270 top
R_SLEW_1  67.45,58.43 0 top
SDO/SA1  32.59,28.84 180 top
SUNSENSOR  82.05,70.88 270 top
U1  83.2,78.43 270 top
U2  10.81,78.43 90 top
U3  58.68,3.31 90 top
U4  65.8,68.08 270 top
U$1  34.05,10.93 0 bottom
U$2  89.42,13.22 90 top
U$3  67.32,55.89 270 top
U$5  36.58,28.51 0 top
U$6  34.91,39.3 90 top
U$8  35.92,53.27 90 top

### Tracks (layer width: path | path; a pad name or v marks a point on that pad's centre or on a via)
3V3_BUCK_ENABLE  (via drill 0.35)
  Top 0.254: v68.08,20.58 68.34,20.84 71.13,20.84 71.87,20.1 BLK1.P3.7_GPIO/PWM | v61.48,20.58 61.48,20.6 57.01,25.07 57.01,44.36 55.64,45.73 v55.64,52.84 | v62.49,68.08 62.49,69.35 63.76,70.62 65.29,70.62 65.54,70.37 U4.RUN
  Route2 0.254: v68.08,20.58 v61.48,20.58 | v55.64,52.84 56.14,53.35 56.14,62.61 58.89,65.35 58.89,67.02 59.45,67.57 61.5,67.57 62,68.08 v62.49,68.08
3V3_BUCK_FB
  Top 0.254: R3.1 67.64,62.88 67.64,62.11 | 67.64,62.11 67.64,61.14 67.45,60.95 65.67,60.95 65.48,61.14 65.48,63.51 R4.2 64.27,65.29 65.05,66.06 U4.FB | 67.64,62.11 67.77,61.99
  Top 0.508: 67.77,61.99 C10.1
  pour Top (no thermals): 69.86,61.22 69.86,65.03 67.57,65.03 67.57,61.22
3V3_BUCK_INTVCC
  Top 0.254: U4.INTVCC 65.55,65.03 65.8,64.78 66.49,64.78 C7.1
3V3_BUCK_PGOOD  (via drill 0.35)
  Top 0.254: v68.08,19.57 68.11,19.6 BLK1.P3.6_GPIO/PWM | v61.48,19.57 61.48,19.58 57.42,23.64 | 57.42,23.64 56.55,24.51 56.55,43.29 54.87,44.97 54.87,53.35 v55.38,53.86 | v63.26,68.84 63.89,69.48 U4.PGOOD | R6.2 57.41,23.63 57.42,23.64
  Route2 0.254: v68.08,19.57 v61.48,19.57 | v55.38,53.86 55.38,62.49 58.43,65.54 58.43,68.08 59.45,69.1 59.45,69.12 60.44,70.11 61.5,70.11 62.77,68.84 v63.26,68.84
  Bottom 0.254: 63.2,68.79 v63.26,68.84
3V3_BUCK_SW
  Top 0.254: U4.SW 66.55,70.37 66.56,70.37 66.9,70.71 L1.P$1
3V3_BUCK_VOUT
  Top 0.508: U$3.P$4 69.76,54.89 R_PULLUP1.2
  Top 0.762: C14.POS 80.78,55.38 80.53,55.13 | C15.POS 80.53,58.43
  Top 0.813: 80.53,55.13 80.39,54.99 R_PULLUP1.2
  Top 1.524: C10.2 80.53,61.99 80.53,58.43 80.53,55.13
  pour Top (no thermals): 72.15,74.43 68.34,74.43 68.34,65.54 70.37,65.54 70.37,60.97 72.15,60.97
  pour Top (no thermals): 69.23,53.1 72.4,53.1 72.4,55 69.23,55
+3V3  (via drill 0.35)
  Top 0.254: v57.67,19.44 57.41,19.7 R6.1
CANH  (via drill 0.35)
  Top 0.254: v48.27,74.43 48.27,73.92 49.03,73.16 49.03,68.7 59.75,57.98 59.75,51.53 60.46,50.82 63.24,50.82 v66.05,48.02 | v69.61,43.24 67.31,43.24 BLK1.CANH
  Route2 0.254: CONN1.P$53 v48.27,74.43 | v66.05,48.02 68.14,45.93 68.14,43.66 68.55,43.24 v69.6,43.24
  Bottom 0.254: v69.6,43.24 v69.61,43.24
CANL  (via drill 0.35)
  Top 0.254: v50.81,74.43 49.54,73.16 49.54,68.84 60.46,57.92 60.46,51.83 63.26,51.83 v66.05,49.03 | BLK1.CANL v68.84,43.95
  Route2 0.254: CONN1.P$57 v50.81,74.43 | v66.05,49.03 68.84,46.24 v68.84,43.95
GND  (via drill 0.3, 0.35, 0.4)
  Top 0.203: C29.2 33.21,43.49 32.59,43.55 v32.59,43.82 | C31.1 40.69,40.53 v40.69,40.82 | U$6.SOC 35.66,41.19 v36.09,41.62 | C37.2 34.22,57.46 33.6,57.52 v33.6,57.79 | C39.1 41.7,54.5 v41.7,54.79 | U$8.SOC 36.67,55.16 v37.1,55.59
  Top 0.254: U4.GND@1 66.55,67.33 U4.GND@PAD | U4.MODE/SYNC 66.05,67.83 U4.GND@PAD | U4.GND@PAD v65.8,68.46 | v66.25,61.86 66.56,62.16 C7.2 66.89,62.48 v66.89,61.86 | R4.1 63.97,62.51 v63.97,61.86 v64.6,61.86 | v69.86,13.34 69.91,13.3 PHOTODIODE.P$3 69.91,11.61 v69.86,11.57 | v81.29,67.95 81.97,67.95 SUNSENSOR.P$3 82.73,67.88 v82.81,67.95 | 66.29,58.18 R_SLEW_1.1 | v86.37,33.66 86.37,34.16 R5.1 86.62,33.92 v86.88,33.66 | 73.42,47.51 v73.67,47.76 | C16.2 73.42,47.51 | 73.42,47.51 v73.67,47.25 | U$5.SDX U$5.SCX 35.43,28.27 36.42,28.27 | 36.42,28.27 36.58,28.11 U$5.GND@1 U$5.GND@2 | 36.42,28.27 v36.47,28.32 | v34.26,31.79 34.93,31.79 C25.2 34.87,32.42 v34.26,32.42 | v39.3,29.89 39.3,29.27 39.49,29.08 | 39.49,29.08 C26.1 | v39.93,29.89 39.93,29.52 39.49,29.08 | v32.27,31.45 32.59,31.11 32.59,31.07 | v32.91,31.45 32.59,31.07 | 32.59,31.07 SDO/SA1.P$1 | U$6.GND 34.69,40.58 v34.69,41.82 | v37.69,35.62 37.39,35.92 C32.1 37.19,35.94 37.4,35.94 v37.69,36.22 | v32.59,43.12 32.96,43.49 33.21,43.49 | U$8.GND 35.7,54.55 v35.7,55.79 | v38.7,49.59 38.4,49.89 C40.1 38.2,49.91 38.42,49.91 v38.7,50.19 | v33.6,57.09 33.97,57.46 34.22,57.46
  Top 0.305: v5.44,80.36 5.31,79.6 5.25,79.54 | 5.25,79.54 C4.1 | v4.8,80.36 5.25,79.79 5.25,79.54 | v12.74,83.86 12.61,83.09 C2.1 11.98,83.29 v12.1,83.86
  Top 0.508: v72.02,51.06 v71.51,51.06 v71,51.06 v70.5,51.06 v69.99,51.06 v69.48,51.06
  Top 0.61: U1.P$2 v80.66,78.43 v80.66,77.8 | v88.3,76.55 88.59,76.84 C3.1 88.59,76.9 v88.94,76.55 | v81.32,83.86 81.32,83.16 C1.1 81.61,83.51 v81.95,83.86 | U2.P$2 v13.35,78.43 v13.35,79.07 | v62.32,72.02 62.74,72.02 C17.2 62.7,71.77 v62.32,71.38 | v67.65,75.7 67.2,75.7 C18.2 67.27,75.45 v67.65,75.07
  Top 0.762: 74.94,59.45 v74.18,60.21 | C15.NEG 74.94,59.45 | v74.94,60.21 74.94,59.45 | v75.7,60.21 75.08,59.59 C15.NEG | v74.18,58.68 74.32,58.68 C15.NEG | v74.94,58.68 75.08,58.82 C15.NEG | v75.7,58.68 75.7,58.82 C15.NEG | C14.NEG 86.23,54.76 v86.37,54.62 | v85.61,54.62 85.61,54.76 C14.NEG | v87.13,54.62 86.99,54.62 C14.NEG | v86.37,56.14 86.37,55.52 C14.NEG | v85.61,56.14 85.61,56 C14.NEG | v87.13,56.14 86.99,56.14 C14.NEG | C22.2 68.85,51.06 v71,51.06 | R_SLEW_1.1 66.16,58.82 C21.2 | v65.92,58.68 v65.92,58.18 66.29,58.18 | v74.31,50.3 v75.07,50.3 74.69,50.68 R_PULLDOWN.1
  Bottom 0.254: v36.47,28.32 36.42,28.27
  other vias: 66.56,68.46 66.56,67.7 65.03,68.46 65.8,67.7 65.03,67.7 75.52,73.42 75.52,72.78 75.52,72.15 74.76,69.61 74.76,68.97 74.76,68.34 74.76,67.7 74.76,67.07 74.76,66.43 74.76,65.8 74.76,65.16 75.52,71.51 75.52,70.75 75.52,69.99 40.69,40.12 41.7,54.09
  pour Top (no thermals): 74.43,64.78 72.65,64.78 72.65,74.43 75.19,74.43 75.19,69.86 74.43,69.86
  pour Top (no thermals): 69.1,52.08 72.4,52.08 72.4,50.56 69.1,50.56
  pour Bottom: 86.54,91.39 92.62,86.3 92.62,7.56 86.54,1.48 7.8,1.48 1.72,7.56 1.72,86.3 7.8,92.39
GPS_ENABLE  (via drill 0.35)
  Top 0.254: U$3.P$5 72.65,55.89 v73.16,56.4 | v73.16,53.86 74.69,53.86 | 74.69,53.86 78.75,53.86 v82.56,50.05 | v82.56,48.02 82.56,28.71 v77.48,23.63 | v72.15,18.04 72.2,18.1 BLK1.P2.2_GPIO/PWM | R_PULLDOWN.2 74.69,53.86
  Route2 0.254: v73.16,56.4 v73.16,53.86 | v82.56,50.05 v82.56,48.02 | v72.15,18.04 72.15,22.87 73.67,24.39 76.72,24.39 v77.48,23.63
GPS_POSITION_VALID  (via drill 0.35)
  Top 0.254: BLK1.P1.7_GPIO/PWM 72.34,21.1 70.82,22.62 v67.83,22.62 | v61.48,22.62 61.48,22.8 57.93,26.35 57.93,46.49 56.91,47.51 56.91,51.57 | 56.91,51.57 56.91,54.87 44.46,67.32 v43.19,67.32 | J1.6 57.66,70.61 v57.66,62.74 | v57.67,51.57 v57.41,51.57 56.91,51.57
  Route2 0.254: v67.83,22.62 v61.48,22.62 | v57.66,62.74 57.41,62.74 56.65,61.99 56.65,52.33 v57.41,51.57 v57.67,51.57 | U3.P$17 42.84,71.92 43.83,70.94 43.83,68.72 43.19,68.08 v43.19,67.32
GPS_RESET_IN  (via drill 0.35)
  Top 0.254: v67.83,21.66 68.03,21.85 70.88,21.85 72.13,20.6 BLK1.P1.6_GPIO/PWM | v61.48,21.6 61.48,21.61 57.47,25.62 57.47,46.3 57.09,46.68 | 57.09,46.68 56.45,47.32 56.45,54.57 44.46,66.56 42.43,66.56 41.41,67.57 34.05,67.57 33.79,67.32 v33.03,67.32 | J1.5 58.43,69.1 v58.43,61.99 | v56.4,45.98 57.09,46.68
  Route2 0.254: v67.83,21.66 61.53,21.66 v61.48,21.6 | v58.43,61.99 57.11,60.66 57.11,53.13 58.38,51.87 58.38,51.28 56.4,49.3 v56.4,45.98 | U3.P$5 31.86,71.52 31.86,70.12 33.03,68.95 v33.03,67.32
GPS_RXD1  (via drill 0.35)
  Top 0.254: v58.18,17.79 55.64,17.79 55.64,41.16 | 55.64,41.16 55.64,41.64 53.96,43.32 53.96,55.65 44.07,65.54 38.62,65.54 v37.35,66.81 | J1.4 61.79,68.03 61.79,67.79 63,66.57 63,60.72 v64.02,60.72 | v54.87,41.16 55.64,41.16 | BLK1.P2.5_GPIO 70.59,17.06 70.11,17.54 v68.08,17.54
  Route2 0.254: v64.02,60.72 64.02,49.03 56.14,41.16 v54.87,41.16 | U3.P$12 36.84,67.32 v37.35,66.81 | v58.18,17.79 58.43,17.79 59.45,18.81 66.81,18.81 v68.08,17.54
GPS_TXD1  (via drill 0.35)
  Top 0.254: 55.57,43.63 54.42,44.78 54.42,55.84 44.26,66 39.94,66 v39.13,66.81 | 55.57,43.63 56.1,43.1 56.1,18.6 58.64,18.6 v59.45,17.79 | J1.3 62.49,64.53 62.49,58.68 62.24,58.43 v62.06,58.43 | v55.11,43.17 55.57,43.63 | v69.61,18.55 70.11,18.55 71.09,17.57 BLK1.P2.6_GPIO/PWM
  Route2 0.254: v62.06,58.43 62.36,58.12 62.79,58.12 63.51,57.4 63.51,49.17 57.51,43.17 v55.11,43.17 | U3.P$11 36.84,71.92 37.83,70.94 37.83,67.35 37.86,67.32 38.62,67.32 v39.13,66.81 | v59.45,17.79 60.53,17.79 60.98,18.23 66.38,18.23 67.79,16.83 68.38,16.83 68.79,17.24 68.79,17.99 69.35,18.55 v69.61,18.55
GPS_VIN  (via drill 0.35)
  Top 0.762: 64.53,53.1 v62.49,55.13 v62.49,57.41 63.26,57.41 | 46.24,66.81 v57.92,55.13 v57.92,57.41 46.24,69.1 | 46.24,68.08 46.24,67.32 | 46.24,68.08 46.24,69.1 | 46.24,67.32 46.24,66.81 | 63.76,56.91 63.26,57.41 | 63.89,56.78 64.53,56.14 64.53,55.89 | 64.53,55.89 64.53,55.38 | 64.53,55.38 64.53,54.87 | 64.53,54.87 64.53,54.37 | 64.53,54.37 64.53,53.86 | 64.53,53.86 64.53,53.1 | 63.89,53.73 63.89,56.78 | 63.13,54.49 63.13,57.29 63.26,57.41 | v57.92,55.89 57.67,55.89 46.24,67.32 | v57.92,56.65 57.67,56.65 46.24,68.08 | U$3.P$2 65.03,55.89 | 65.03,55.89 64.53,55.89 | 64.53,55.38 65.8,55.38 | 64.53,54.87 66.3,54.87 | 64.53,53.1 66.3,53.1 | 64.53,54.37 66.3,54.37 66.56,54.11 | 64.53,53.86 65.91,53.86 C_SLEW_1.1 66.42,51.71 C22.1 | 46.24,66.81 44.71,68.34 27.95,68.34 26.84,69.44 U3.P$2 26.84,70.2 27.95,69.1 | 46.24,67.32 44.71,68.84 28.2,68.84 27.95,69.1 | 46.24,68.08 45.22,69.1 | 45.22,69.1 27.95,69.1 | 46.24,69.1 45.22,69.1 | 63.26,57.41 64.78,57.41 64.78,56.14 65.03,55.89 | C21.1 63.76,56.91 | 63.76,56.91 63.89,56.78
  Route2 0.762: v62.49,55.13 v57.92,55.13 | v57.92,57.41 v62.49,57.41 | v62.49,56.65 v57.92,56.65 | v57.92,55.89 v62.49,55.89
  Bottom 0.762: v62.49,57.41 v62.49,55.89 v62.49,55.13 | v57.92,55.13 v57.92,56.65 v57.92,57.41
  pour Top (isolate 0.305, no thermals): 67.32,56.14 67.32,52.84 65.8,52.84 65.8,56.14
I2C_SCL  (via drill 0.35)
  Top 0.254: 75.96,22.1 BLK1.P5.1_I2C-SCL-1 73.17,22.1 73.16,22.11 | 75.96,22.1 77.21,22.1 88.37,33.25 88.37,40.94 J3.3 | v75.96,23.12 75.96,22.1 | J4.3 79.51,6.61 79.51,4.82 78.72,4.02 62.04,4.02 61.22,4.84 J2.3 61.16,5.41 R2.2 | v57.41,4.84 57.41,14.07 54.27,17.22 54.27,23.08 52.59,24.76 J_IMU.2
  Route2 0.254: v75.96,23.12 75.96,11.44 76.46,10.93 76.46,3.82 76.72,3.57 82.05,3.57 82.05,6.61 J4.3 | v57.41,4.84 J2.3 | J_MAG1.2 52.59,29.75 53.86,28.48 53.86,27.42 52.59,26.15 J_IMU.2
I2C_SCL_2  (via drill 0.35)
  Top 0.254: BLK1.P7.1_I2C-SCL-2 64.54,20.6 65.42,21.48 v65.42,23.51
  Route2 0.254: v65.42,23.51 65.61,23.32 68.12,23.32 70.31,21.13 70.31,18.12 68.56,16.37 67.6,16.37 66.43,17.54 62.79,17.54 61.71,16.46 58.51,16.46 57.47,17.5 57.47,18.08 57.88,18.5 58.49,18.5 58.49,22.05 57.67,22.87 57.67,31.25 54.62,34.3 52.06,34.3 51.32,35.04 51.32,36.1 47.25,40.16 47.25,43.97 48,44.71 49.05,44.71 50.32,43.44 J_MAG2.2
I2C_SDA  (via drill 0.35)
  Top 0.254: 77.48,21.6 BLK1.P5.0_I2C-SDA-1 | 77.48,21.6 89.08,33.2 89.08,40.87 88.15,41.8 88.15,42.95 87.4,43.7 86.35,43.7 85.08,42.43 J3.1 | v77.48,20.33 77.48,21.6 | J2.2 60.34,6.38 59.32,5.36 59.32,4.31 60.06,3.57 80.02,3.57 80.78,4.33 J4.1 | J2.2 61.41,7.38 R1.2 | J2.2 59.7,7.38 57.92,9.15 57.92,14.21 54.72,17.41 54.72,25.07 53.11,26.68 52.06,26.68 50.79,25.41 J_IMU.4
  Route2 0.254: v77.48,20.33 77.48,13.22 79.51,11.19 79.51,6.36 v80.53,5.34 | J_MAG1.4 50.05,29.75 51.32,28.48 51.32,27.42 50.05,26.15 J_IMU.4
  Bottom 0.254: v80.53,5.34 J4.1
I2C_SDA_2  (via drill 0.35)
  Top 0.254: v64.6,24.33 64.6,21.58 64.11,21.1 BLK1.P7.0_I2C-SDA-2
  Route2 0.254: J_MAG2.4 48.52,40.41 52.09,36.84 53.11,36.84 58.99,30.96 58.99,20.04 59.41,19.62 59.99,19.62 60.41,20.04 60.41,24.33 v64.6,24.33
IMU_SCL  (1 unrouted)
  Top 0.254: U$5.SCL 36.58,29.94 35.95,30.57 34.62,30.57 34.11,30.06 31.57,30.06 30.49,28.98 30.49,25.22 31.93,23.78 31.93,22.51 31.95,22.49 32.68,22.49 | J_IMU.1 51.84,27.95 50.57,26.68 49.52,26.68 48.78,25.94 48.78,24.88 48.15,24.26 48.03,24.14 44.77,20.88 34.03,20.88 33.57,21.34 33.57,21.65 R10.2
IMU_SDA
  Top 0.254: 32.91,24.75 R9.2 | U$5.SDA 36.08,29.79 35.76,30.11 34.81,30.11 34.22,29.52 31.68,29.52 30.95,28.79 30.95,25.71 31.95,24.71 32.68,24.71 R9.2 | J_IMU.3 49.3,27.95 48.03,26.68 46.98,26.68 41.64,21.34 34.22,21.34 34.03,21.53 34.03,23.42 R9.2
LDO_3V3  (via drill 0.35)  (2 unrouted)
  Top 0.203: 77.56,40.22 BLK1.3.3V@CAN2
  Top 0.254: BLK1.3.3V@MSP1 77.39,27.19 77.99,27.19 78.62,27.82 | 78.62,27.82 79.26,28.46 79.26,37.86 78.75,38.36 77.73,38.36 | 60.31,16.01 60.31,19.72 v59.7,20.33 | v61.48,28.2 61.31,28.2 BLK1.3.3V_ANALOG@MSP2 | v79.26,27.19 78.62,27.82 | 65.29,12.46 64.27,13.47 64.27,15.5 60.43,15.5 BLK1.3.3V@MSP2 60.31,16.01 | 65.29,12.46 PHOTODIODE.P$4 | 67.07,45.22 67.07,49.29 68.84,47.51 | 67.07,45.22 67.32,45.22 | 68.84,47.51 72.41,43.94 72.41,40.13 73.16,39.38 76.72,39.38 77.56,40.22 | BLK1.3.3V@CAN1 65.47,43.37 65.92,43.82 65.92,44.97 66.18,45.22 67.07,45.22 | R1.1 64.21,11.37 64.78,11.95 | 64.78,11.95 65.29,12.46 | R2.1 64.78,8.58 64.78,11.95 | C16.1 68.84,47.51 | 37.08,30.43 37.08,32.03 C25.1 | 37.08,30.43 U$5.CS | 36.08,26.93 U$5.VDDIO | 36.08,26.93 37.67,26.93 | 37.67,26.93 37.67,27.69 U$5.VDD | C26.2 39.45,26.93 37.67,26.93 | 34.81,26.94 SDO/SA1.P$3 | 34.81,26.94 36.07,26.94 36.08,26.93 | 37.67,26.93 v37.67,26.3 | v37.67,30.43 37.08,30.43 | 34.81,26.94 34.76,26.89 R10.1 | 60.31,16.01 60.32,16.02 60.32,16.03 59.27,17.08 55.7,17.08 55.18,17.6 55.18,23.46 55.18,30.74 | R9.1 R10.1 | R10.1 34.81,22.21 | U$6.VDD 34.66,36.94 | 34.66,36.94 34.68,37.22 35.59,37.22 | 35.59,37.22 35.69,37.22 35.69,38.02 U$6.!SPI_CS | 34.66,36.22 34.66,36.94 | 35.59,37.22 36.99,37.22 36.99,38.36 | 36.99,38.36 36.99,39.02 36.99,39.05 U$6.I2C/!SPI | 34.66,36.22 31.89,36.22 31.89,39.52 32.45,40.08 33.63,40.08 U$6.VDDIO | 34.66,36.22 34.84,36.22 C32.2 37.07,34.04 C25.1 | 43.38,40.42 R12.1 R11.1 37.08,38.27 36.99,38.36 | 43.38,40.42 43.38,40.51 C31.2 43.8,40.51 45.79,38.52 49.2,38.52 50.82,40.14 53.6,40.14 | 43.31,40.54 43.31,40.49 43.38,40.42
  Top 0.254: U$8.VDD 35.67,50.91 | 35.67,50.91 35.69,51.19 36.6,51.19 | 36.6,51.19 36.71,51.19 36.71,51.99 U$8.!SPI_CS | 35.67,50.19 35.67,50.91 | 36.6,51.19 38,51.19 38,52.29 | U$8.I2C/!SPI 38.01,53.02 38.01,52.99 38,52.99 38,52.29 | 35.67,50.19 32.9,50.19 32.9,53.49 33.47,54.05 34.64,54.05 U$8.VDDIO | C40.2 35.85,50.19 35.67,50.19 | 38,52.29 R15.1 R16.1 44.39,54.39 | 44.39,54.39 44.39,54.48 C39.2 44.81,54.48 46.8,52.49 52.43,52.49 53.5,51.42 53.5,40.24 53.6,40.14 | 44.32,54.51 44.32,54.46 44.39,54.39 | 53.6,40.14 55.18,38.56 55.18,30.74 | C25.1 37.13,32.01 38.36,32.01 39.63,30.74 55.18,30.74
  Top 0.508: C4.2 5.09,76.46 6.11,75.45 56.4,75.45 | 56.4,75.45 62.24,75.45 62.75,74.94 v62.75,73.16 v63.26,73.16 | 67.07,49.29 63.51,52.84 61.48,52.84 61.22,53.1 61.22,57.99 56.4,62.81 56.4,75.45 | SUNSENSOR.P$4 80.46,66.38 78.75,68.08 78.75,68.91 78.24,69.42 v78.24,74.43 v79.26,74.43
  Top 0.61: U2.P$5 C6.1 C4.2
  Route2 0.254: v59.7,20.33 59.7,26.43 v61.48,28.2 62.49,27.19 v79.26,27.19 | v37.67,26.3 v37.67,30.43
  Route2 0.508: v63.26,73.16 73.82,73.16 74.93,74.28 v78.09,74.28 | v78.24,74.43 v79.26,74.43
  Bottom 0.508: v78.09,74.28 v78.24,74.43
  other vias: 78.75,74.43
LDO_3V3_BYP
  Top 0.61: U2.P$4 C6.2
LDO_5V
  Top 0.254: 76.72,46.24 76.72,46.07 BLK1.5V
  Top 0.508: C3.2 90.06,79.38 90.43,79 90.43,75.7 90.18,75.45 77.73,75.45 76.72,74.43 76.72,68.89 83.96,61.66 86.7,61.66 89.16,59.19 89.16,50.56 87.64,49.03 77.73,49.03 76.72,48.02 76.72,46.07
  Top 0.61: U1.P$5 C5.1 C3.2 88.59,79.39
LDO_5V_BYP
  Top 0.61: U1.P$4 C5.2
MA1G_C2
  Top 0.203: U$6.C1 35.16,41.29 35.39,41.52 35.39,43.25 C29.1
MAG1_SCL  (via drill 0.35)
  Top 0.254: U$6.SCL/SPI_SCK 33.79,37.66 v33.79,37.02 | v38.99,35.62 39.79,36.42 41.31,36.42 R11.2 41.44,36.42 42.39,37.37 50.79,37.37 J_MAG1.1
  Route2 0.254: v33.79,37.02 36.09,34.72 38.99,34.72 v38.99,35.62
MAG1_SDA  (via drill 0.35)
  Top 0.254: U$6.SDA/SPI_SDI 32.9,37.82 v32.69,37.82 | v40.09,35.02 40.46,35.39 42.27,35.39 43.3,36.42 R12.2 46.61,36.47 46.98,36.84 48.78,36.84 J_MAG1.3
  Route2 0.254: v32.69,37.82 33.03,37.48 33.03,36.71 35.52,34.21 39.2,34.21 v40.01,35.02
  Bottom 0.254: v40.01,35.02 v40.09,35.02
MAG1_SETC1
  Top 0.203: U$6.SETC 34.16,41.25 33.89,41.52 33.89,42.22 34.19,42.52 34.19,44.62 37.06,44.62 C30.1
MAG1_SETP1
  Top 0.254: U$6.SETP 37.52,40.05 C30.2
MAG2_C1
  Top 0.203: U$8.C1 36.17,55.26 36.4,55.49 36.4,57.22 C37.1
MAG2_SCL  (via drill 0.35)
  Top 0.254: U$8.SCL/SPI_SCK 34.8,51.63 v34.8,50.99 | v40,49.59 40.8,50.39 42.32,50.39 R15.2 42.46,50.39 43.41,51.34 50.02,51.34 51.06,50.3 J_MAG2.1
  Route2 0.254: v34.8,50.99 37.1,48.69 40,48.69 v40,49.59
MAG2_SDA  (via drill 0.35)
  Top 0.254: U$8.SDA/SPI_SDI 33.92,51.79 v33.7,51.79 | v41.1,48.99 41.47,49.36 43.28,49.36 44.31,50.39 R16.2 47.51,50.44 48.52,49.43 J_MAG2.3
  Route2 0.254: v33.7,51.79 34.05,51.45 34.05,50.68 36.54,48.18 40.21,48.18 v41.02,48.99
  Bottom 0.254: v41.02,48.99 v41.1,48.99
MAG2_SETC
  Top 0.203: U$8.SETC 35.17,55.22 34.9,55.49 34.9,56.19 35.2,56.49 35.2,58.59 38.07,58.59 C38.1
MAG2_SETP
  Top 0.254: U$8.SETP 38.53,54.02 C38.2
N$1  (via drill 0.35)
  Top 0.254: U$2.8 v87.2,28.65 77.64,19.1 BLK1.P3.5_GPIO_DEBUG | D1.A v84.59,31.25
  Route2 0.254: v84.59,31.25 v87.2,28.65
N$2
  Top 0.203: U$3.P$1 66.79,57.52 67.33,57.52 67.98,58.18 R_SLEW_1.2
N$3
  Top 0.254: U$2.7 79.43,18.6 BLK1.P3.4_GPIO_DEBUG
N$4
  Top 0.203: C_SLEW_1.2 68.22,54.12 67.77,54.57 67.77,56.21 68.01,56.45 68.04,56.45 U$3.P$6 69.76,56.89 R_PULLUP1.1
N$5
  Top 0.254: U$2.4 86.3,17.6 BLK1.P2.1_RXD
N$6
  Top 0.254: U$2.3 87.65,18.3 85.1,15.75 BLK1.P2.0_TXD
N$7
  Top 0.254: U$2.2 85.76,15.76 84.49,14.49 72.4,14.49 72.09,14.79 BLK1.SBWTDIO
N$8
  Top 0.254: BLK1.SBWTCK 71.59,14.28 71.89,13.98 84.59,13.98 85.35,13.22 U$2.SBWTCK
N$9
  Top 0.508: D1.C 85.33,35.8 85.75,36.22 R5.2
N$11
  Top 0.254: SDO/SA1.P$2 34.49,28.84 34.92,29.26 U$5.SDO/SA0
PHOTODIODE_SCL
  Top 0.254: J4.4 75.19,10.93 71.89,10.93 71.41,11.42 PHOTODIODE.P$2
PHOTODIODE_SDA
  Top 0.254: J4.2 76.47,7.12 76.47,8.29 74.29,10.47 71.7,10.47 70.78,11.4 70.78,13.09 70.97,13.29 71.84,13.29 72.67,12.46 PHOTODIODE.P$1
SUNSENSOR_SCL
  Top 0.254: J3.4 86.88,46.8 90.2,50.12 90.2,63.99 82.69,71.51 81.42,71.51 81.22,71.31 81.22,70.44 82.05,69.61 SUNSENSOR.P$2
SUNSENSOR_SDA
  Top 0.254: SUNSENSOR.P$1 84.34,68.59 84.34,64.84 89.75,59.43 89.75,50.31 87.88,48.45 87.82,48.45 J3.2
SYNC1  (via drill 0.35)
  Top 0.254: v43.19,74.43 44.46,74.43 45.22,73.67 45.85,73.67 48.07,71.45 48.07,68.38 58.84,57.6 58.84,26.73 59.45,26.12 64.46,26.12 67.05,23.53 67.05,15.79 BLK1.P7.2_SYNC1
  Route2 0.254: CONN1.P$45 v43.19,74.43
SYNC2  (via drill 0.35)
  Top 0.254: v45.73,74.43 48.52,71.64 48.52,68.57 59.3,57.79 59.3,48.42 v59.7,48.02 | BLK1.PJ.3_SYNC2 66.59,23.34 64.27,25.66 59.26,25.66 58.38,26.54 58.38,47.25 57.92,47.71 v57.92,48.02
  Route2 0.254: CONN1.P$49 v45.73,74.43 | v57.92,48.02 v59.7,48.02
VBAT
  Top 0.254: U1.P$1 | U2.P$3 | 12.16,80.74 C2.2 | U4.V_IN 66.05,70.62 65.54,71.13 65.54,71.38 65.29,71.64
  Top 0.508: 81.61,81.29 C1.2 | U2.P$1
  Top 0.61: U1.P$1 83.2,79.39 83.2,77.48 | 83.2,77.48 83.19,77.48 U1.P$3 | U1.P$1 81.61,79.62 81.61,81.29 | U2.P$3 10.81,79.39 10.81,77.48 | 10.81,77.48 U2.P$1 | 12.16,80.74 U2.P$3 | 83.2,77.48 83.2,76.34 83.07,76.21 81.29,76.21 80.78,76.72 63.51,76.72 63.51,76.34 63.38,76.21 10.81,76.21 10.81,77.48
  Top 1.524: CONN1.P$78 CONN1.P$77 63.51,76.72 64.78,75.45 64.78,74.94
  pour Top (no thermals): 65.67,71 64.02,71 64.02,76.72 65.67,76.72

### Text on the board
tDocu: SUN_S
tSilk: HMC5983 2 | SDA | SCL | GND | MAG2 | HMC5983 1 | MAG1 | IMU | GND | SDA | SCL | LSM6DSM